# EasyEDA Pro project ProPrj_red-panda-afm_2025-05-21.epro, board PCB1
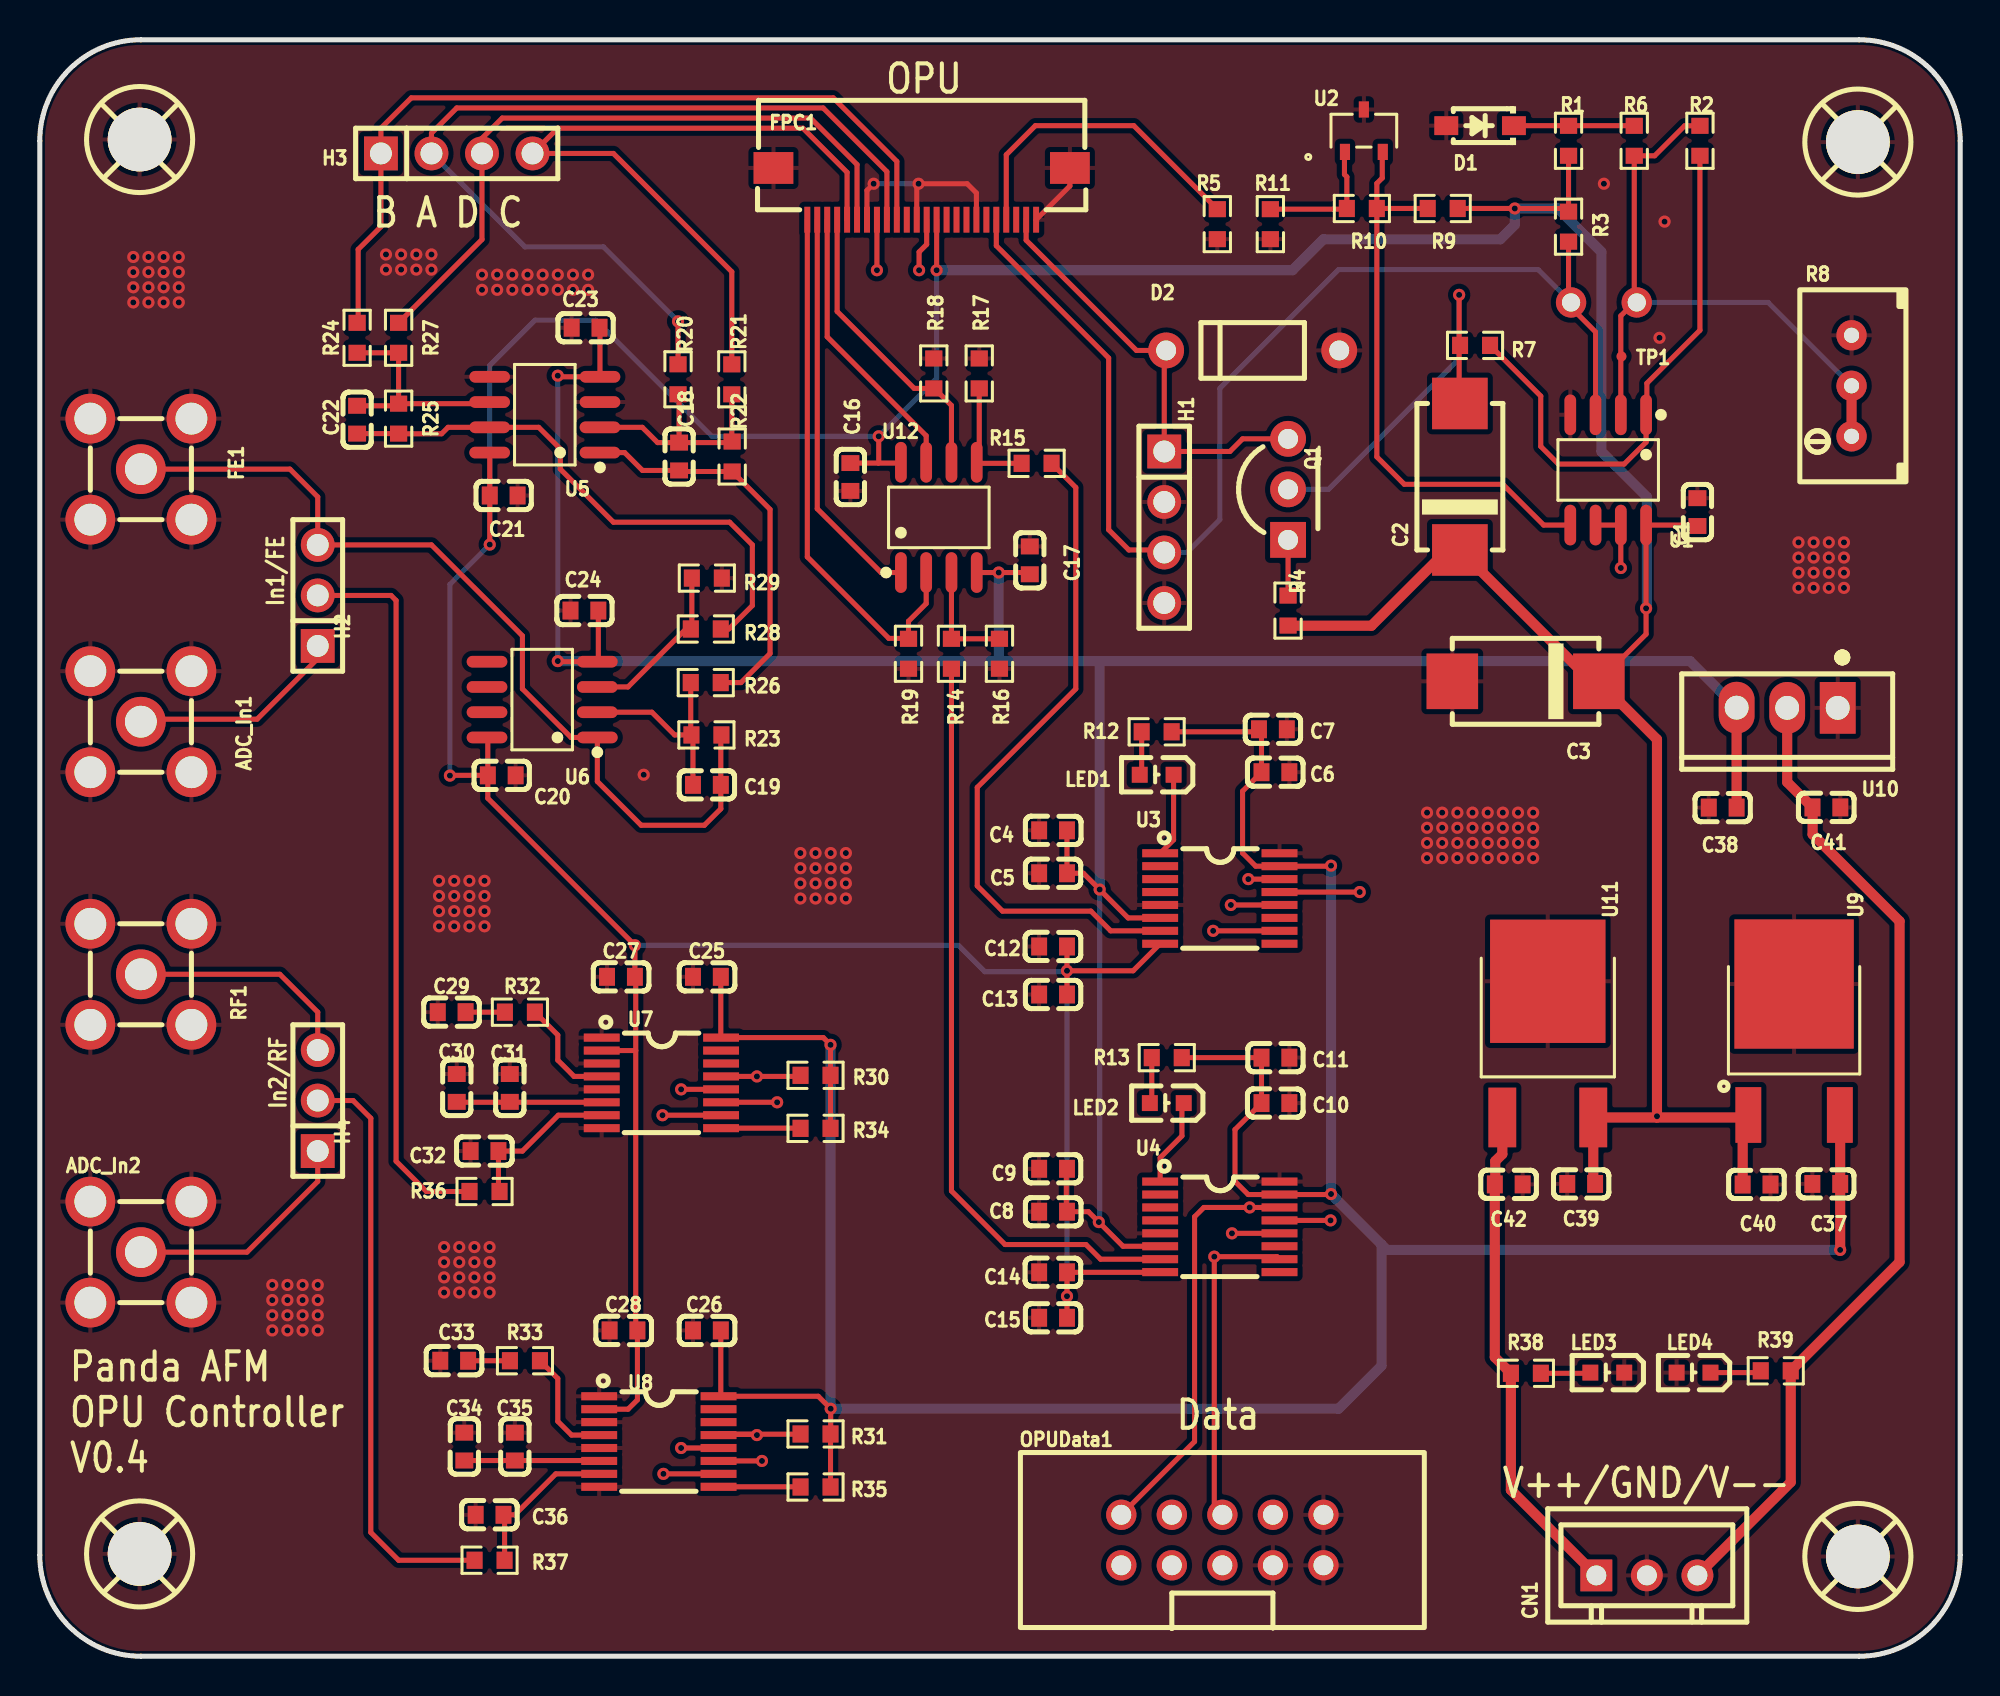
[diagram p14: board, top side]
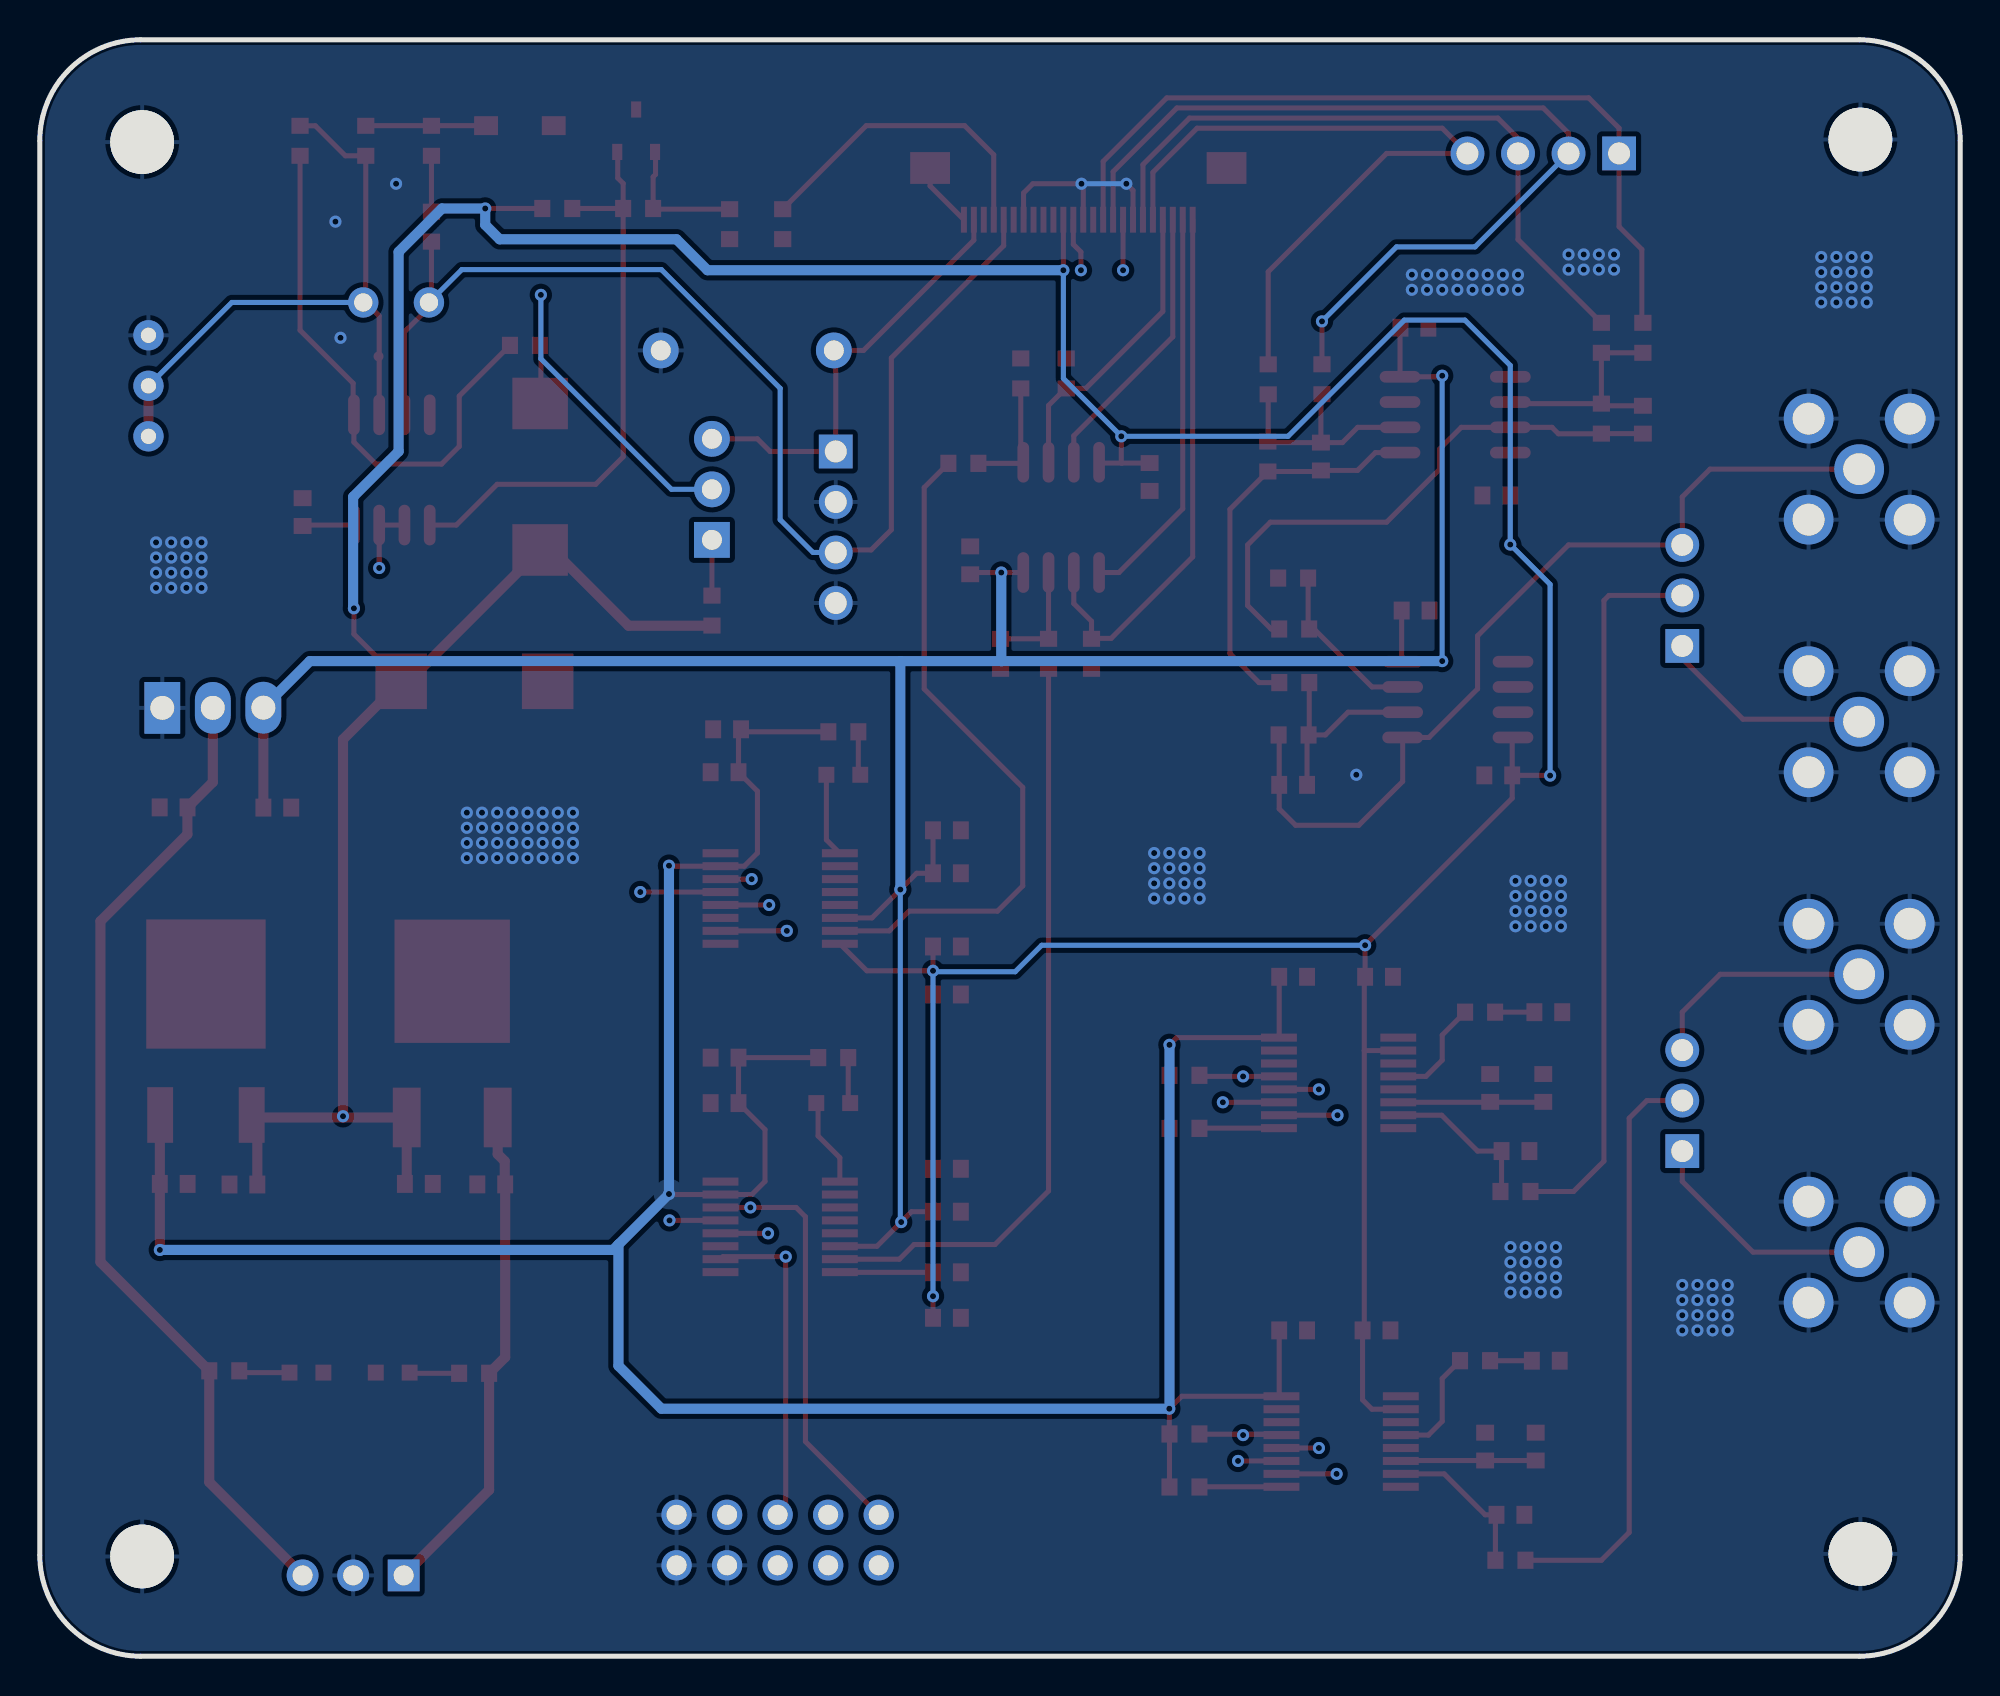
[diagram p15: board, bottom side, seen from below]

Outline 96.52 x 81.28 mm; copper layers: Top Layer, Inner1, Inner2, Bottom Layer. Coordinates in mm from the lower left corner of the outline.
Outline path: 0,76.2 0,5.08 arc(1.49,1.49) 5.08,0 91.44,0 arc(95.03,1.49) 96.52,5.08 96.52,76.2 arc(95.03,79.79) 91.44,81.28 5.08,81.28 arc(1.49,79.79) 0,76.2
Stack: Top Layer 0.035mm Outer layer copper thickness 1oz / Dielectric1 0.2104mm 7628 RC49% 8.6mil / Inner1 0.0152mm Inner layer copper thickness / Dielectric2 1.065mm 1.1mm H/HOZ Copper / Inner2 0.0152mm Inner layer copper thickness / Dielectric3 0.2104mm 7628 RC49% 8.6mil / Bottom Layer 0.035mm Outer layer copper thickness 1oz

## Design rules (mm)
template: JLCPCB Capability(Two Layers Board)
spacing copperThickness1oz (default): track to track 0.102, other pairs 0.152 to 0.3
spacing copperThickness2oz: track to track 0.203, other pairs 0.152 to 0.3
track width copperThickness1oz (default): min 0.127, default 0.254, max 2.54
track width copperThickness2oz: min 0.203, default 0.254, max 2.54
differential pair differentialPair (default): width min 0.127, default 0.254, max 2.54; gap min 0.152, default 0.152
via viaSize (default): diameter min 0.5, default 0.61, max 10; hole min 0.3, default 0.305, max 6.3

## Placement (name value [footprint] x y rotation side)
ADC_In1  -  [SMA-TH_KH-SMA-KE-Z]  5.08 46.99 0 top
ADC_In2  -  [SMA-TH_KH-SMA-KE-Z]  5.08 20.32 0 top
C1  100nF  [C0603]  83.31 57.53 270 top
C2  100uF  [C2917]  71.37 59.31 90 top
C3  100uF  [C2917]  74.68 49.02 180 top
C4  10uF  [C0603]  50.93 41.53 180 top
C5  100nF  [C0603]  50.93 39.37 180 top
C6  10uF  [C0603]  62.1 44.45 0 top
C7  100nF  [C0603]  61.98 46.61 0 top
C8  10uF  [C0603]  50.93 22.35 180 top
C9  100nF  [C0603]  50.93 24.51 180 top
C10  10uF  [C0603]  62.1 27.81 0 top
C11  100nF  [C0603]  62.1 30.1 0 top
C12  10uF  [C0603]  50.93 35.69 0 top
C13  100nF  [C0603]  50.93 33.27 0 top
C14  10uF  [C0603]  50.93 19.3 0 top
C15  100nF  [C0603]  50.93 17.02 0 top
C16  100nF  [C0603]  40.74 59.3 270 top
C17  100nF  [C0603]  49.76 55.1 90 top
C18  100nF  [C0603]  32.13 60.33 90 top
C19  100nF  [C0603]  33.53 43.81 180 top
C20  100nF  [C0603]  23.22 44.29 180 top
C21  100nF  [C0603]  23.31 58.37 180 top
C22  100nF  [C0603]  15.95 62.18 90 top
C23  100nF  [C0603]  27.43 66.8 0 top
C24  100nF  [C0603]  27.37 52.58 0 top
C25  1uF  [C0603]  33.53 34.16 180 top
C26  1uF  [C0603]  33.53 16.38 180 top
C27  1uF  [C0603]  29.21 34.16 180 top
C28  1uF  [C0603]  29.34 16.38 180 top
C29  10uF  [C0603]  20.7 32.39 0 top
C30  22uF  [C0603]  20.95 28.58 270 top
C31  1uF  [C0603]  23.62 28.58 270 top
C32  330pF  [C0603]  22.35 25.4 0 top
C33  10uF  [C0603]  20.83 14.86 0 top
C34  22uF  [C0603]  21.34 10.54 270 top
C35  1uF  [C0603]  23.88 10.54 270 top
C36  330pF  [C0603]  22.61 7.11 0 top
C37  1uF  [C0603]  89.79 23.75 0 top
C38  100nF  [C0603]  84.58 42.67 0 top
C39  100nF  [C0603]  77.47 23.75 0 top
C40  4.7uF  [C0603]  86.29 23.72 0 top
C41  0.33uF  [C0603]  89.79 42.68 0 top
C42  0.33uF  [C0603]  73.83 23.73 0 top
CN1  ZX-XH2.54-3PZZ  [CONN-TH_3P-P2.54_2501S-3P]  80.77 4.06 0 top
D1  MMSZ4679T1G  [SOD-123_L2.7-W1.6-LS3.7-RD-1]  72.39 76.96 180 top
D2  -  [DO-41_BD2.4-L4.7-P8.70-D0.9-RD]  60.96 65.66 0 top
FE1  -  [SMA-TH_KH-SMA-KE-Z]  5.08 59.69 0 top
FPC1  AFC01-S24FCA-00  [FPC-SMD_P0.50-24P_FGS-XJ-H2.0]  44.32 73.53 0 top
H1  PZ254V-11-04P  [HDR-TH_4P-P2.54-V-M]  56.51 56.77 270 top
H2  PZ254V-11-03P  [HDR-TH_3P-P2.54-V-M]  13.97 53.34 90 top
H3  PZ254V-11-04P  [HDR-TH_4P-P2.54-V-M]  20.95 75.56 0 top
H4  PZ254V-11-03P  [HDR-TH_3P-P2.54-V-M]  13.97 27.94 90 top
LED1  -  [LED0603-R-RD]  56.13 44.32 180 top
LED2  -  [LED0603-R-RD]  56.64 27.81 180 top
LED3  -  [LED0603-R-RD]  78.78 14.26 180 top
LED4  -  [LED0603-R-RD]  83.12 14.26 180 top
NOREF  -  [Pad_e2081]  76.96 68.07 0 top
NOREF#2  -  [Pad_e3316]  80.26 68.07 0 top
OPUData1  2.54-2*5P简牛  [IDC-TH_10P-P2.54_C5665]  59.44 5.84 0 top
Q1  2N3906BU  [TO-92-3_L4.8-W3.7-P2.54-L]  62.74 58.67 90 top
R1  100  [R0603]  76.84 76.2 270 top
R2  820K  [R0603]  83.44 76.2 270 top
R3  2.2M  [R0603]  76.84 71.88 90 top
R4  6.8  [R0603]  62.74 52.58 270 top
R5  1M  [R0603]  59.18 72.01 270 top
R6  10kΩ  [R0603]  80.14 76.2 270 top
R7  1K  [R0603]  72.14 65.91 180 top
R8  5kΩ  [RES-ADJ-TH_3296W]  91.06 63.88 180 top
R9  6.8K  [R0603]  70.51 72.8 0 top
R10  10kΩ  [R0603]  66.45 72.8 0 top
R11  7.14K  [R0603]  61.85 72.01 90 top
R12  10kΩ  [R0603]  56.13 46.48 180 top
R13  10kΩ  [R0603]  56.64 30.1 180 top
R14  51K  [R0603]  45.82 50.41 270 top
R15  51K  [R0603]  50.1 59.98 0 top
R16  1K  [R0603]  48.23 50.41 90 top
R17  1K  [R0603]  47.22 64.5 270 top
R18  0R22  [R0603]  44.93 64.5 270 top
R19  0R22  [R0603]  43.66 50.41 90 top
R20  1K  [R0603]  32.08 64.21 270 top
R21  1K  [R0603]  34.78 64.21 270 top
R22  1K  [R0603]  34.8 60.33 270 top
R23  1K  [R0603]  33.5 46.33 0 top
R24  1K  [R0603]  15.95 66.29 270 top
R25  1K  [R0603]  18.03 62.23 90 top
R26  1K  [R0603]  33.47 48.96 180 top
R27  1K  [R0603]  18.03 66.29 270 top
R28  1K  [R0603]  33.47 51.65 180 top
R29  1K  [R0603]  33.53 54.21 180 top
R30  10kΩ  [R0603]  38.99 29.21 0 top
R31  10kΩ  [R0603]  38.99 11.18 0 top
R32  0.47  [R0603]  24.13 32.39 0 top
R33  0.47  [R0603]  24.38 14.86 0 top
R34  10kΩ  [R0603]  38.99 26.54 0 top
R35  10kΩ  [R0603]  38.99 8.51 0 top
R36  0.47  [R0603]  22.35 23.37 180 top
R37  0.47  [R0603]  22.61 4.83 180 top
R38  10kΩ  [R0603]  74.69 14.23 0 top
R39  10kΩ  [R0603]  87.25 14.35 0 top
RF1  -  [SMA-TH_KH-SMA-KE-Z]  5.08 34.29 0 top
SCREW1  -  [Screw-Hole-M3]  5.08 5.08 0 top
SCREW2  -  [Screw-Hole-M3]  91.44 5.08 90 top
SCREW3  -  [Screw-Hole-M3]  91.44 76.2 90 top
SCREW4  -  [Screw-Hole-M3]  5.08 76.2 0 top
TP1  -  [Test-Point-0.5mm]  79.5 65.36 0 top
U1  LT1807IS8#PBF  [SOIC-8_L4.9-W3.9-P1.27-LS6.0-BL]  78.83 59.65 180 top
U2  LM4041CYM3-ADJ-TR  [SOT-23_M3_MCH]  66.55 76.71 0 top
U3  AD5761RBRUZ  [TSSOP-16_L5.0-W4.4-P0.65-LS6.4-TL]  59.31 38.1 0 top
U4  AD5761RBRUZ  [TSSOP-16_L5.0-W4.4-P0.65-LS6.4-TL]  59.31 21.59 0 top
U5  LT1807IS8#PBF  [SOIC-8_L4.9-W3.9-P1.27-LS6.0-BL]  25.38 62.43 90 top
U6  LT1807IS8#PBF  [SOIC-8_L4.9-W3.9-P1.27-LS6.0-BL]  25.25 48.1 90 top
U7  -  [TSSOP-16_L5.0-W4.4-P0.65-LS6.4-TL]  31.24 28.83 0 top
U8  -  [TSSOP-16_L5.0-W4.4-P0.65-LS6.4-TL]  31.12 10.79 0 top
U9  BD733L5FP-CE2  [TO-252-3L_L6.6-W6.1-P4.60-LS9.5-BR-CW]  88.17 30.51 270 top
U10  LM7905T  [TO-220-3_L10.0-W4.5-P2.54-L]  87.82 47.69 180 top
U11  MC7805CDTG  [DPAK_L6.6-W6.2-P2.29-LS9.7-BR]  75.79 30.51 270 top
U12  AD8397ARZ-REEL7  [SOIC-8_L4.9-W3.9-P1.27-LS6.0-BL]  45.19 57.26 0 top

## Footprints (pads in the part's own frame, mm; a bottom-side part is the same pattern mirrored in y, then rotated)
C0603
  rect 0.8x0.9 smd: 1(-0.7,0) 2(0.7,0)
C2917
  rect 2.591x2.794 smd: 1(-3.683,0) 2(3.683,0)
CONN-TH_3P-P2.54_2501S-3P
  rect 1.6x1.6 hole 1: 1(-2.54,0)
  round 1.6 hole 1: 2(0,0) 3(2.54,0)
DO-41_BD2.4-L4.7-P8.70-D0.9-RD
  round 1.8 hole 1: 1(-4.35,0) 2(4.35,0)
DPAK_L6.6-W6.2-P2.29-LS9.7-BR
  rect 3x1.4 smd: 1(3.424,-2.286) 3(3.424,2.286)
  rect 6.2x5.8 smd: 2(-3.424,0)
FPC-SMD_P0.50-24P_FGS-XJ-H2.0
  rect 0.3x1.3 smd: 1(-5.748,-1.3) 2(-5.248,-1.3) 3(-4.748,-1.3) 4(-4.248,-1.3) 5(-3.748,-1.3) 6(-3.248,-1.3) 7(-2.748,-1.3) 8(-2.248,-1.3) 9(-1.748,-1.3) 10(-1.248,-1.3) 11(-0.748,-1.3) 12(-0.248,-1.3) 13(0.252,-1.3) 14(0.752,-1.3) 15(1.252,-1.3) 16(1.752,-1.3) 17(2.252,-1.3) 18(2.752,-1.3) 19(3.252,-1.3) 20(3.752,-1.3) 21(4.252,-1.3) 22(4.752,-1.3) 23(5.252,-1.3) 24(5.752,-1.3)
  rect 2x1.6 smd: 25(7.45,1.3) 26(-7.45,1.3)
HDR-TH_3P-P2.54-V-M
  rect 1.7x1.7 hole 1.1: 1(-2.54,0)
  round 1.7 hole 1.1: 2(0,0) 3(2.54,0)
HDR-TH_4P-P2.54-V-M
  rect 1.7x1.7 hole 1.1: 1(-3.81,0)
  round 1.7 hole 1.1: 2(-1.27,0) 3(1.27,0) 4(3.81,0)
IDC-TH_10P-P2.54_C5665
  round 1.524 hole 1: 1(-5.08,-1.27) 2(-5.08,1.27) 3(-2.54,-1.27) 4(-2.54,1.27) 5(0,-1.27) 6(0,1.27) 7(2.54,-1.27) 8(2.54,1.27) 9(5.08,-1.27) 10(5.08,1.27)
LED0603-R-RD
  rect 0.8x0.8 smd: 1(0.851,0) 2(-0.851,0)
Pad_e2081
  round 1.524 hole 0.914: 1(0,0)
Pad_e3316
  round 1.524 hole 0.914: 1(0,0)
R0603
  rect 0.806x0.864 smd: 1(-0.753,0) 2(0.753,0)
RES-ADJ-TH_3296W
  round 1.524 hole 0.762: 1(0,2.54) 2(0,0) 3(0,-2.54)
Screw-Hole-M3
  round 3.2 hole 3.2: 1(-0.064,0.064)
SMA-TH_KH-SMA-KE-Z
  round 2.499 hole 1.6: 1(-2.54,-2.54) 2(-2.54,2.54) 3(2.54,2.54) 4(2.54,-2.54) 5(0,0)
SOD-123_L2.7-W1.6-LS3.7-RD-1
  rect 1.2x0.95 smd: 1(-1.7,0) 2(1.7,0)
SOIC-8_L4.9-W3.9-P1.27-LS6.0-BL
  oval 0.588x2.045 smd: 1(-1.905,-2.772) 2(-0.635,-2.772) 3(0.635,-2.772) 4(1.905,-2.772) 5(1.905,2.772) 6(0.635,2.772) 7(-0.635,2.772) 8(-1.905,2.772)
SOT-23_M3_MCH
  rect 0.508x0.813 smd: 1(-0.95,-1.067) 2(0.95,-1.067) 3(0,1.067)
Test-Point-0.5mm
  round 0.5 smd: 1(0,0)
TO-92-3_L4.8-W3.7-P2.54-L
  rect 1.8x1.8 hole 1: 1(-2.54,0)
  round 1.8 hole 1: 2(0,0) 3(2.54,0)
TO-220-3_L10.0-W4.5-P2.54-L
  rect 1.8x2.6 hole 1.2: 1(-2.54,0.005)
  oval 1.8x2.6 hole 1.2: 2(0,0.005) 3(2.54,-0.005)
TO-252-3L_L6.6-W6.1-P4.60-LS9.5-BR-CW
  rect 2.8x1.3 smd: 1(3.292,-2.3) 3(3.292,2.3)
  rect 6.5x6 smd: 2(-3.292,0)
TSSOP-16_L5.0-W4.4-P0.65-LS6.4-TL
  rect 1.804x0.406 smd: 1(-2.999,2.276) 2(-2.999,1.625) 3(-2.999,0.976) 4(-2.999,0.325) 5(-2.999,-0.325) 6(-2.999,-0.976) 7(-2.999,-1.625) 8(-2.999,-2.276) 9(2.999,-2.276) 10(2.999,-1.625) 11(2.999,-0.976) 12(2.999,-0.325) 13(2.999,0.325) 14(2.999,0.976) 15(2.999,1.625) 16(2.999,2.276)

## Nets
As in the schematic, except:
MD: FPC1.20 H1.3 NOREF.1 R3.1 U1.3
$1N7980: NOREF#2.1 R2.1 R6.2 R8.1 R8.2 TP1.1 U1.2

Pads without a net: FPC1 16 22; U3 2 3 4 9 11; U4 2 3 4 9 11; U6 5 6 7; U7 14 15; U8 14 15

## Via types
v1: diameter 0.61, hole 0.305, Top Layer to Bottom Layer, 199 vias

## Routing (per net, layer and track width the routed paths; a pad name or vN(x,y) marks a point on that pad's centre or on a via; arc(x,y) is an arc through that point)
2.1V: length 48.9
  Top Layer w0.254: U1.6 U1.7 v1(79.46,54.72) ; v1(44.19,69.69) 44.19,70.61 44.57,70.99 FPC1.13
  Inner1 w0.254: v1(79.46,54.72) 79.46,54.57 78.87,53.97 76.71,53.97 67.94,62.74 50.16,62.74 44.19,68.71 v1(44.19,69.69)
2.1VREF: length 29.1
  Top Layer w0.254: R10.2 67.2,60.31 68.58,58.93 73.53,58.93 75.58,56.88 U1.5 ; R10.2 R9.1 ; R10.2 67.2,74.06 67.47,74.33 67.47,75.62
3.3V: length 160.9
  Top Layer w0.254: R13.1 C11.1 C10.1 60.07,26.48 60.07,23.88 60.73,23.22 U4.15 64.87,23.22 v1(64.9,23.24) ; R34.2 v1(39.74,30.74) 39.38,31.11 U7.16 34.23,31.12 C25.1 ; v1(64.9,39.75) 64.87,39.73 U3.15 61.11,39.73 60.45,40.39 60.45,43.5 C6.1 61.4,46.48 C7.1 61.15,46.48 R12.1 ; C26.1 34.23,13.18 U8.16 39.13,13.07 v1(39.75,12.45) 39.75,11.18 R31.2 R35.2
  Top Layer w0.508: v1(90.49,20.43) 90.49,27.2 U9.3
  Bottom Layer w0.508: 67.44,20.7 67.44,14.61 65.28,12.45 v1(39.75,12.45) 39.74,12.45 v1(39.74,30.74) ; 67.44,20.7 67.71,20.43 v1(90.49,20.43) ; 67.44,20.7 v1(64.9,23.24) v1(64.9,39.75)
+5V: length 292.6
  Top Layer w0.254: U4.8 56.3,19.3 51.63,19.3 v1(51.63,18.1) 51.63,17.02 ; C20.2 22.52,43.14 v1(29.91,35.75) C27.1 29.95,34.12 29.95,30.45 ; C20.2 22.52,46.16 U6.8 ; C20.2 20.62,44.29 v1(20.61,44.28) ; 42.14,60 C16.1 ; 42.14,60 42.16,60.02 v1(42.16,61.34) ; 42.14,60 43.24,60 U12.8 ; R9.2 v1(74.13,72.8) 76.67,72.8 R3.2 R1.2 ; 29.95,30.45 U7.2 ; 29.95,30.45 29.95,16.47 C28.1 30.04,12.89 29.57,12.42 U8.2 ; 78.36,49.02 80.73,51.4 v1(80.73,52.69) U1.8 83.26,56.88 C1.2 ; v1(51.63,34.47) 54.95,34.47 U3.8 ; v1(51.63,34.47) 51.63,33.66 51.5,33.53 ; v1(51.63,34.47) 51.63,35.69 ; v1(22.61,55.9) C21.2 22.61,60.52 U5.8 ; FPC1.14 v1(45.07,69.69)
  Top Layer w0.508: 81.28,27.09 81.28,46.1 78.36,49.02 77.98,49.02 C2.1 70.74,55.63 66.93,51.82 62.75,51.82 R4.2 ; 81.28,27.09 85.75,27.09 U9.1 ; 81.28,27.09 U11.3 78.08,23.84 C39.2 ; C40.1 85.59,26.93
  Bottom Layer w0.254: v1(51.63,18.1) v1(51.63,34.47) 51.58,34.42 47.5,34.42 46.17,35.75 v1(29.91,35.75) ; v1(45.07,69.69) 45.07,64.25 v1(42.16,61.34) 33.78,61.34 27.94,67.18 24.89,67.18 22.61,64.91 v1(22.61,55.9) 20.61,53.9 v1(20.61,44.28)
  Bottom Layer w0.508: 80.77,52.7 80.77,58.29 78.49,60.58 78.49,70.61 76.3,72.8 v1(74.13,72.8) 74.13,71.97 73.41,71.25 64.52,71.25 62.96,69.69 v1(45.07,69.69)
  vias: v1(81.28,27.15)
-5V: length 139.4
  Top Layer w0.254: U3.6 54.7,37.12 v1(53.27,38.55) 52.45,39.37 51.75,39.37 ; C23.2 28.15,66.78 28.15,64.33 26.09,64.33 v1(26.03,64.39) ; v1(26.03,50.04) 26.06,50.01 U6.4 28.07,50.06 C24.2 ; 51.63,24.51 51.59,24.48 51.59,22.39 51.63,22.35 52.71,22.35 v1(53.23,21.83) 54.44,20.61 U4.6 ; 51.63,41.53 51.63,39.37 ; U12.4 v1(48.2,54.49) 49.67,54.49 C17.1
  Top Layer w0.508: U10.3 85.28,42.67
  Bottom Layer w0.254: v1(53.27,38.55) 53.27,21.87 v1(53.23,21.83) ; v1(26.03,50.04) v1(26.03,64.39)
  Bottom Layer w0.508: 53.27,50.04 82.94,50.04 U10.3 ; 53.27,50.04 v1(53.27,38.55) ; 53.27,50.04 48.2,50.04 ; v1(26.03,50.04) 48.2,50.04 ; 48.2,50.04 v1(48.2,54.49)
GND: length 13.8
  Top Layer w0.254: FPC1.24 51.77,73.93 FPC1.25 ; v1(41.91,74.04) 41.57,73.71 FPC1.7 ; FPC1.18 47.07,73.58 46.61,74.04 v1(44.17,74.04) 44.07,73.95 FPC1.12
  Bottom Layer w0.254: v1(41.91,74.04) v1(44.17,74.04)
  vias: v1(4.7,70.36) v1(4.7,69.6) v1(4.7,68.83) v1(4.7,68.07) v1(5.46,70.36) v1(5.46,69.6) v1(5.46,68.83) v1(5.46,68.07) v1(6.22,70.36) v1(6.22,69.6) v1(6.22,68.83) v1(6.22,68.07) v1(6.98,70.36) v1(6.98,69.6) v1(6.98,68.83) v1(6.98,68.07) v1(11.68,18.67) v1(11.68,17.91) v1(11.68,17.14) v1(11.68,16.38) v1(12.45,18.67) v1(12.45,17.91) v1(12.45,17.14) v1(12.45,16.38) v1(13.21,18.67) v1(13.21,17.91) v1(13.21,17.14) v1(13.21,16.38) v1(13.97,18.67) v1(13.97,17.91) v1(13.97,17.14) v1(13.97,16.38) v1(17.4,70.48) v1(17.4,69.72) v1(18.16,70.48) v1(18.16,69.72) v1(18.92,70.48) v1(18.92,69.72) v1(19.69,70.48) v1(19.69,69.72) v1(20.07,38.99) v1(20.07,38.23) v1(20.07,37.47) v1(20.07,36.7) v1(20.32,20.57) v1(20.32,19.81) v1(20.32,19.05) v1(20.32,18.29) v1(20.83,38.99) v1(20.83,38.23) v1(20.83,37.47) v1(20.83,36.7) v1(21.08,20.57) v1(21.08,19.81) v1(21.08,19.05) v1(21.08,18.29) v1(21.59,38.99) v1(21.59,38.23) v1(21.59,37.47) v1(21.59,36.7) v1(21.84,20.57) v1(21.84,19.81) v1(21.84,19.05) v1(21.84,18.29) v1(22.22,69.47) v1(22.22,68.71) v1(22.35,38.99) v1(22.35,38.23) v1(22.35,37.47) v1(22.35,36.7) v1(22.61,20.57) v1(22.61,19.81) v1(22.61,19.05) v1(22.61,18.29) v1(22.99,69.47) v1(22.99,68.71) v1(23.75,69.47) v1(23.75,68.71) v1(24.51,69.47) v1(24.51,68.71) v1(25.27,69.47) v1(25.27,68.71) v1(26.03,69.47) v1(26.03,68.71) v1(26.8,69.47) v1(26.8,68.71) v1(27.56,69.47) v1(27.56,68.71) v1(30.35,44.32) v1(38.23,40.39) v1(38.23,39.62) v1(38.23,38.86) v1(38.23,38.1) v1(38.99,40.39) v1(38.99,39.62) v1(38.99,38.86) v1(38.99,38.1) v1(39.75,40.39) v1(39.75,39.62) v1(39.75,38.86) v1(39.75,38.1) v1(40.51,40.39) v1(40.51,39.62) v1(40.51,38.86) v1(40.51,38.1) v1(69.72,42.42) v1(69.72,41.66) v1(69.72,40.89) v1(69.72,40.13) v1(70.49,42.42) v1(70.49,41.66) v1(70.49,40.89) v1(70.49,40.13) v1(71.25,42.42) v1(71.25,41.66) v1(71.25,40.89) v1(71.25,40.13) v1(72.01,42.42) v1(72.01,41.66) v1(72.01,40.89) v1(72.01,40.13) v1(72.77,42.42) v1(72.77,41.66) v1(72.77,40.89) v1(72.77,40.13) v1(73.53,42.42) v1(73.53,41.66) v1(73.53,40.89) v1(73.53,40.13) v1(74.29,42.42) v1(74.29,41.66) v1(74.29,40.89) v1(74.29,40.13) v1(75.06,42.42) v1(75.06,41.66) v1(75.06,40.89) v1(75.06,40.13) v1(78.61,74.04) v1(81.41,66.29) v1(81.66,72.14) v1(88.39,56.01) v1(88.39,55.25) v1(88.39,54.48) v1(88.39,53.72) v1(89.15,56.01) v1(89.15,55.25) v1(89.15,54.48) v1(89.15,53.72) v1(89.92,56.01) v1(89.92,55.25) v1(89.92,54.48) v1(89.92,53.72) v1(90.68,56.01) v1(90.68,55.25) v1(90.68,54.48) v1(90.68,53.72)
A: length 46.2
  Top Layer w0.254: H3.2 19.69,76.58 20.95,77.85 39.37,77.85 42.57,74.65 FPC1.9 ; R20.1 v1(32.08,67.12)
  Bottom Layer w0.254: H3.2 24.38,70.87 28.33,70.87 v1(32.08,67.12)
ADC_CS0: length 37.7
  Top Layer w0.254: U7.11 v1(37.06,27.85)
  Inner1 w0.254: v1(37.06,27.85) 52.59,12.32 59.06,12.32 61.98,9.4 OPUData1.8
ADC_CS1: length 22.4
  Top Layer w0.254: U8.11 v1(36.3,9.82)
  Inner1 w0.254: v1(36.3,9.82) 41.54,4.57 OPUData1.1
ADC_IN1: length 36.6
  Top Layer w0.254: H2.2 17.65,53.34 17.91,53.09 17.91,24.89 19.43,23.37 R36.2
ADC_IN2: length 29.7
  Top Layer w0.254: H4.2 15.75,27.94 16.64,27.05 16.64,6.22 18.03,4.83 R37.2
B: length 41.1
  Top Layer w0.254: R24.1 16,67.1 16,70.74 17.14,71.88 H3.1 17.14,76.84 18.67,78.36 39.88,78.36 43.07,75.16 FPC1.10
C: length 36.8
  Top Layer w0.254: FPC1.5 40.57,74.61 38.35,76.84 26.03,76.84 H3.4 28.83,75.56 34.78,69.61 R21.1
D: length 34
  Top Layer w0.254: FPC1.6 41.07,75 38.74,77.34 23.24,77.34 22.22,76.33 H3.3 22.22,71.24 R27.1
DAC_CS0: length 45.1
  Top Layer w0.254: U3.13 v1(66.34,38.42)
  Inner1 w0.254: v1(66.34,38.42) 65.22,38.42 64.01,37.21 64.01,11.68 63.25,10.92 63.25,6.48 62.61,5.84 58.17,5.84 OPUData1.3
DAC_CS1: length 31
  Top Layer w0.254: U4.13 v1(64.87,21.92)
  Inner1 w0.254: OPUData1.5 59.44,3.81 60.96,2.29 65.28,2.29 66.93,3.94 66.93,8.64 64.87,10.69 v1(64.87,21.92)
DVDLD: length 22
  Top Layer w0.254: Q1.3 60.45,61.21 59.82,60.58 H1.1 56.51,65.56 D2.1 55.12,65.66 49.57,71.2 FPC1.23
F+: length 20.1
  Top Layer w0.254: U12.1 42.28,54.49 39.07,57.7 FPC1.2
F-: length 27.4
  Top Layer w0.254: FPC1.1 38.57,55.28 42.67,51.18 43.64,51.18 R19.2 43.66,52.04 44.55,52.93 U12.2
FE: length 44.9
  Top Layer w0.254: FE1.5 12.57,59.69 13.97,58.29 H2.3 19.69,55.88 24.26,51.31 24.26,48.64 26.7,46.2 U6.1 28.02,43.99 30.23,41.78 33.4,41.78 34.23,42.61 C19.1 34.23,46.3 R23.2
FOUT: length 38.2
  Top Layer w0.254: U4.7 53.31,19.96 52.58,20.7 48.51,20.7 45.82,23.39 R14.2
HFM: length 16.2
  Top Layer w0.254: R5.1 54.98,76.96 50.04,76.96 48.57,75.5 FPC1.21
IN1: length 10.8
  Top Layer w0.254: ADC_In1.5 5.21,47.12 10.92,47.12 13.97,50.17 H2.1
IN2: length 11.9
  Top Layer w0.254: H4.1 13.97,23.88 10.41,20.32 ADC_In2.5
INA-1: length 11.8
  Top Layer w0.254: C18.2 31.05,61.03 30.28,61.79 28.15,61.79 ; C18.2 32.13,63.4 R20.2 ; C18.2 34.74,61.03 R22.1 34.78,61.1 R21.2
INB-1: length 11.4
  Top Layer w0.254: R25.2 R27.2 R24.2 ; R25.2 22.53,62.98 U5.6 ; R25.2 17.93,62.88 C22.2
MD: length 61.4
  Top Layer w0.254: R3.1 76.84,67.95 78.19,66.59 U1.3 ; H1.3 56.39,55.63 54.74,55.63 53.72,56.64 53.72,65.28 48.07,70.92 FPC1.20
  Bottom Layer w0.254: H1.3 57.66,55.5 59.31,57.15 59.31,63.75 65.28,69.72 75.31,69.72 NOREF.1
OUTA-1: length 20.1
  Top Layer w0.254: 28.15,60.52 29.39,60.52 30.29,59.62 C18.1 32.18,59.57 R22.2 36.7,57.67 36.7,50.42 35.24,48.96 R26.1
OUTB-1: length 28.2
  Top Layer w0.254: C22.1 R25.1 18.04,61.47 20.19,61.47 20.52,61.79 U5.7 25.08,61.79 26.16,60.71 26.16,59.69 28.83,57.02 34.67,57.02 35.81,55.88 35.81,52.83 34.63,51.65 34.23,51.65
RF: length 68.3
  Top Layer w0.254: FPC1.8 v1(42.07,69.69) ; RF1.5 12.06,34.29 13.97,32.39 H4.3
  Inner1 w0.254: v1(42.07,69.69) 12.64,40.26 6.73,40.26 5.08,38.61 RF1.5
SCLK: length 84.5
  Top Layer w0.254: U3.14 v1(60.74,39.08) ; U7.12 v1(32.23,28.5) ; OPUData1.2 58.04,10.79 58.04,22.1 58.51,22.57 v1(60.81,22.57) U4.14 ; U8.12 v1(32.23,10.47)
  Inner1 w0.254: v1(60.81,22.57) 60.74,22.63 v1(60.74,39.08) ; OPUData1.2 51,10.47 v1(32.23,10.47) v1(32.23,28.5)
SDI: length 86.9
  Top Layer w0.254: 62.31,37.78 v1(59.86,37.78) ; U7.10 v1(31.3,27.2) ; U4.12 v1(59.92,21.27) ; U8.10 v1(31.34,9.17)
  Inner1 w0.254: v1(31.34,9.17) 31.3,9.22 v1(31.3,27.2) ; v1(59.92,21.27) 59.86,21.32 v1(59.86,37.78)
  Inner2 w0.254: v1(31.34,9.17) 54.84,9.17 OPUData1.4 59.92,10.13 v1(59.92,21.27)
SDO: length 89.4
  Top Layer w0.254: 38.24,29.08 38.16,29.15 v1(36.04,29.15) U7.13 ; 34.17,11.18 34.18,11.16 38.22,11.16 R31.1 ; U8.13 34.15,11.15 36.01,11.15 v1(36.04,11.12) ; U3.10 v1(58.97,36.47) ; U4.10 62.18,20.09 v1(59.03,20.09) 59.03,7.52 OPUData1.6
  Inner1 w0.254: v1(59.03,20.09) 59.03,36.42 v1(58.97,36.47) ; OPUData1.6 55.43,11.12 v1(36.04,11.12) v1(36.04,29.15)
T+: length 14.3
  Top Layer w0.254: U12.7 44.55,61.37 39.57,66.34 FPC1.3
T-: length 15.2
  Top Layer w0.254: U12.6 45.82,62.89 44.96,63.75 R18.2 43.95,63.75 40.07,67.62 FPC1.4
TOUT: length 33.9
  Top Layer w0.254: U3.7 53.82,36.47 52.83,37.47 48.39,37.47 47.12,38.73 47.12,43.69 52.07,48.64 52.07,58.77 R15.2
V++: length 25.3
  Top Layer w0.508: U11.1 73.51,25.25 73.15,24.89 73.15,23.75 73.13,23.73 73.13,15.03 R38.1 73.94,8.36 CN1.1
V--: length 50.2
  Top Layer w0.508: U10.2 87.82,43.95 C41.1 89.1,42.67 89.1,41.33 93.47,36.96 93.47,19.82 R39.2 88,8.75 CN1.3
VREF: length 6.6
  Top Layer w0.254: 65.57,75.52 65.57,74.51 65.69,74.39 R10.1 65.66,72.76 R11.2
$1N1382: length 2.8
  Top Layer w0.254: Q1.1 R4.1
$1N1385: length 20
  Top Layer w0.254: C2.2 71.34,63.03 v1(71.34,68.45)
  Bottom Layer w0.254: v1(71.34,68.45) 71.34,65.24 64.77,58.67 Q1.2
$1N7976: length 6.1
  Top Layer w0.254: D1.1 80.13,76.96 R6.1
$1N7980: length 32.2
  Top Layer w0.254: R2.1 82.67,76.95 81.16,75.45 R6.2 80.14,68.07 79.46,67.4 U1.2
  Top Layer w0.508: R8.1 R8.2
  Bottom Layer w0.254: 80.39,68.07 86.87,68.07 R8.2
$1N9531: length 27.8
  Top Layer w0.254: R2.2 83.44,66.67 80.77,64.01 80.77,62.46 U1.1 80.73,61.05 79.63,59.94 76.33,59.94 75.44,60.83 75.44,63.36 R7.1
$3N416: length 5.7
  Top Layer w0.254: R16.2 R14.1 U12.3
$3N901: length 6
  Top Layer w0.254: R17.2 47.22,60.16 U12.5 47.14,59.98 R15.1
$3N2421: length 4.4
  Top Layer w0.254: LED2.2 57.4,27.72 57.4,26.16 56.31,25.07 U4.1
$3N2422: length 2.3
  Top Layer w0.254: LED2.1 55.89,27.91 R13.2
$3N2440: length 4.2
  Top Layer w0.254: LED1.2 56.99,41.05 U3.1
$3N2441: length 2.2
  Top Layer w0.254: R12.2 55.38,44.42 LED1.1
$4N1135: length 10.4
  Top Layer w0.254: R23.1 31.91,46.33 30.76,47.47 U6.2 ; R23.1 32.72,46.36 R26.2 ; R23.1 32.83,46.25 C19.2
$4N1234: length 8.5
  Top Layer w0.254: U6.3 29.56,48.74 32.48,51.65 R28.2 32.77,51.71 R29.2
$6N539: length 5.4
  Top Layer w0.254: R32.2 26.03,31.23 26.03,29.97 26.85,29.15 U7.4
$6N540: length 2
  Top Layer w0.254: C29.2 R32.1
$6N541: length 7.3
  Top Layer w0.254: U7.6 20.98,27.85 C30.2
$6N553: length 4
  Top Layer w0.254: R34.1 38.23,26.55 34.24,26.55
$6N555: length 8
  Top Layer w0.254: R36.1 23.05,23.42 C32.2 24.26,25.4 26.06,27.2 U7.7
$6N1064: length 5.8
  Top Layer w0.254: R33.2 26.03,13.96 26.03,11.81 26.73,11.12 U8.4
$6N1065: length 2.1
  Top Layer w0.254: C33.2 R33.1
$6N1066: length 6.8
  Top Layer w0.254: C34.2 C35.2 28.09,9.84 U8.6
$6N1078: length 4.4
  Top Layer w0.254: 33.86,8.52 38.23,8.52 R35.1
$6N1080: length 8
  Top Layer w0.254: R37.1 23.36,7.06 C36.2 23.88,7.11 25.93,9.17 U8.7
$6N3346: length 2.5
  Top Layer w0.254: LED3.1 77.9,14.23 R38.2
$6N3348: length 2.6
  Top Layer w0.254: LED4.2 86.41,14.26 R39.1

## Copper pours and planes (outline as drawn; the poured copper is in the pictures)
GND on Top Layer: -7.37,88.27 108.08,88.27 108.08,-22.99 -7.37,-22.99
GND on Bottom Layer: -9.78,92.2 113.92,92.2 113.92,-33.66 -9.78,-33.66

## Text on the board
Top Silkscreen Layer: In1/FE | In2/RF | Panda AFM / OPU Controller / V0.4 | B A D C | OPU | Data | V++/GND/V--
